# Altium schematic sheet Llave_analogica.SchDoc
size A
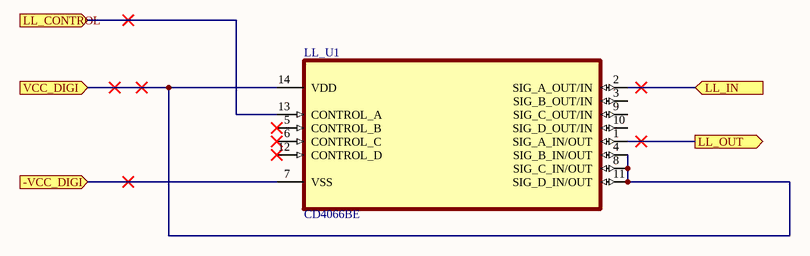
[diagram p0: Llave_analogica.SchDoc]

## Parts
LL_U1  CD4066BE  [DIP254P762X508-14]

## Ports
-VCC_DIGI (in), LL_CONTROL (in), LL_IN (in), LL_OUT (out), VCC_DIGI (in)

## Nets
-VCC_DIGI: LL_U1.7(VSS) ; port -VCC_DIGI
LL_CONTROL: LL_U1.13(CONTROL_A) ; port LL_CONTROL
LL_IN: LL_U1.2(SIG_A_OUT/IN) ; port LL_IN
LL_OUT: LL_U1.1(SIG_A_IN/OUT) ; port LL_OUT
VCC_DIGI: LL_U1.4(SIG_B_IN/OUT) LL_U1.8(SIG_C_IN/OUT) LL_U1.11(SIG_D_IN/OUT) LL_U1.14(VDD) ; port VCC_DIGI

Not connected (* = marked no-connect by the designer): LL_U1 3(SIG_B_OUT/IN) 5(CONTROL_B)* 6(CONTROL_C)* 9(SIG_C_OUT/IN) 10(SIG_D_OUT/IN) 12(CONTROL_D)*

## Library data of the parts
LL_U1 = CD4066BE: Bilateral, FET Switches 1 x 1:1 14-PDIP; MF: Texas Instruments; SnapEDA_Link: https://www.snapeda.com/parts/CD4066BE/Texas%20Instruments/view-part/2771603/?ref=snap; Price: None; Availability: Unavailable; Package: PDIP-14 RCA; MP: CD4066BE; Value: *